# Altium schematic sheet TK511_DC-PSU.SchDoc
size A4; DocumentNumber: 3; SheetNumber: 3; SheetTotal: 8
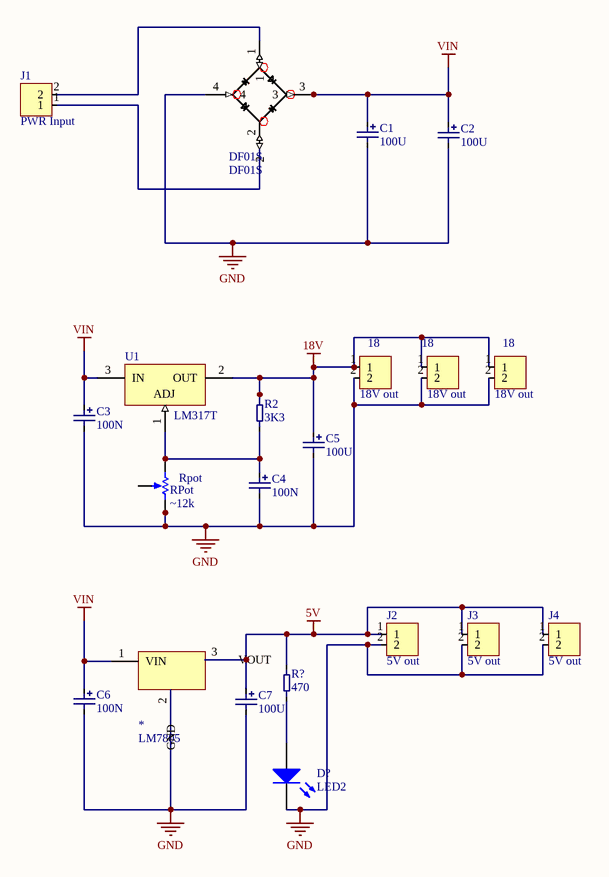
[diagram p0: TK511_DC-PSU.SchDoc]

## Parts
(Parts that share a designator on the sheet are numbered #1, #2 ... from top to bottom, then left to right.)
18#1  18V out  [JST 2pin]
18#2  18V out  [JST 2pin]
18#3  18V out  [JST 2pin]
*  LM7805  [221A-06]
C1  100U  [CAP 2.5mm]
C2  100U  [CAP 2.5mm]
C3  100N  [RAD-0.2]
C4  100N  [RAD-0.2]
C5  100U  [CAP 2.5mm]
C6  100N  [RAD-0.2]
C7  100U  [CAP 2.5mm]
D?  LED2  [6-0805_L]
DF01S  DF01S  [DF01S_PCB]
J1  PWR Input  [JST 2pin]
J2  5V out  [JST 2pin]
J3  5V out  [JST 2pin]
J4  5V out  [JST 2pin]
R2  3K3  [Axial 1/4W]
R?  470  [6-0805_N]
Rpot  RPot  value ~12k  [VR5]
U1  LM317T  [221A-06]

## Nets
5V: *.3(VOUT) C7.2 J2.1 J3.1 J4.1 R?.2
18V: 18#1.1 18#2.1 18#3.1 C5.2 R2.2 U1.2(OUT)
GND: 18#1.2 18#2.2 18#3.2 *.2(GND) C1.1 C2.1 C3.1 C4.1 C5.1 C6.1 C7.1 D?.2(K) DF01S.4 J2.2 J3.2 J4.2 Rpot.2(BOT)
VIN: *.1(VIN) C1.2 C2.2 C3.2 C6.2 DF01S.3 U1.3(IN)
NetC4_2: C4.2 R2.1 Rpot.1(TOP) U1.1(ADJ)
NetD?_1: D?.1(A) R?.1
NetDF01S_1: DF01S.1 J1.2
NetDF01S_2: DF01S.2 J1.1

Not connected (* = marked no-connect by the designer): Rpot 3(TAP)

## Library data of the parts
18#1-18#3 J1-J4 = JST 2pin
C1-C7 = CAP
D? = LED2: Typical RED, GREEN, YELLOW, AMBER GaAs LED; Published: 8-Jun-2000; LatestRevisionDate: 17-Jul-2002; LatestRevisionNote: Re-released for DXP Platform.; PackageVersion: Feb-2002; PackageReference: 3.2X1.6X1.1; Publisher: Altium Limited; PackageDescription: SM LED; 2 Flat Leads
DF01S = DF01S: Likeretterbro
R2 R? = R: Value: 10R
Rpot = RPot: Potentiometer; Sim Note: Enter the Resistance value and the set point into parameter fields.; Set Position: 0.5; Published: 8-Jun-2000; LatestRevisionDate: 17-Jul-2002; LatestRevisionNote: Re-released for DXP Platform.; PackageReference: VR5; Publisher: Altium Limited; PackageDescription: Variable Resistor, Thru-Hole; 3 Leads
U1 = LM317T: Three-Terminal Adjustable Output Positive Voltage Regulator; Note: Heatsink surface connected to Pin 2; Published: 15-Apr-2002; DatasheetVersion: 1996; PackageVersion: 1997; PackageReference: 221A-06; Publisher: Altium Limited; PackageDescription: TO, Thru-Hole, Vertical, Heatsink Mounted; 3 In-Line Leads; Pitch 2.54 mm; Code_JEDEC: TO-262-AA; ComponentLink1Description: Manufacturer Link; ComponentLink1URL: http://www.onsemi.com/site/products/taxonomy/0,4438,503,00.html; ComponentLink2Description: Datasheet; ComponentLink2URL: http://www.onsemi.com/pub/Collateral/LM317-D.PDF